# Altium schematic sheet STM32F103ZET6_HARDWARE.SchDoc: The robot embedded motherboar
size A4; CompanyName: 中煤科工集团重庆研究院; DrawnBy: leiyitan; Engineer: leiyitan@qq.com; Revision: V3.0; SheetNumber: 1; DocumentName: STM32F103ZET6_HARDWARE.SchDoc
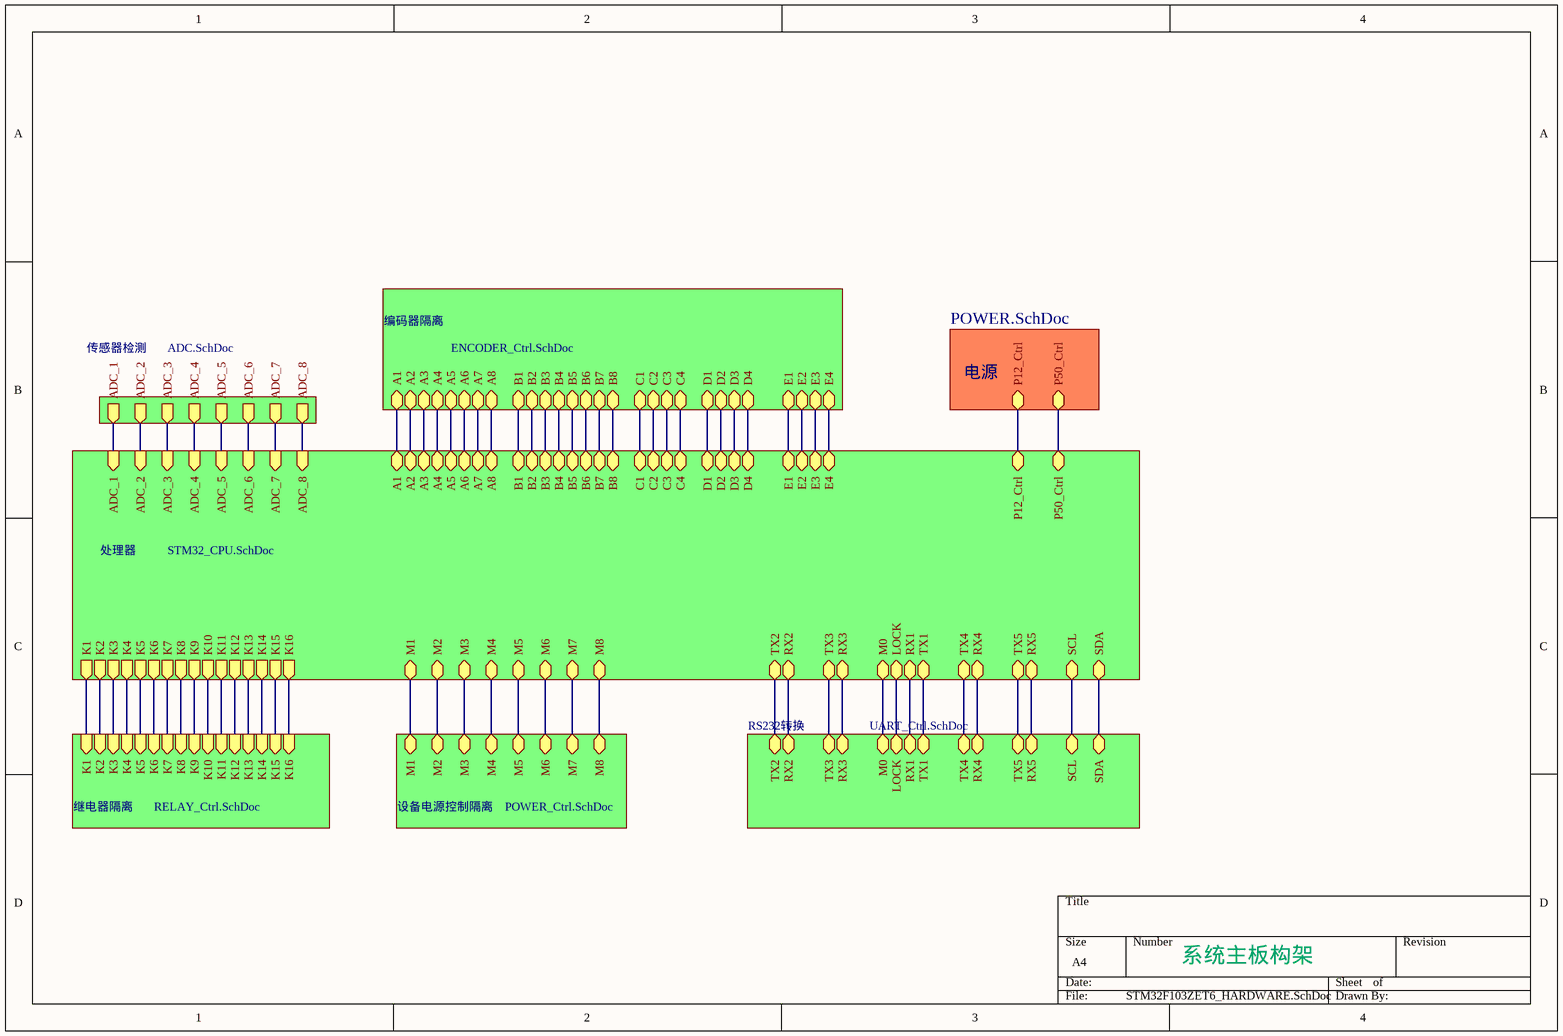
[diagram p0: STM32F103ZET6_HARDWARE.SchDoc]

## Sub-sheets
RS232转换 = UART_Ctrl.SchDoc: TX2, RX2, TX3, RX3, RX1, TX1, RX4 (bidir), TX4 (bidir), TX5 (bidir), RX5 (bidir), SCL (bidir), SDA (bidir), LOCK, M0
传感器检测 = ADC.SchDoc: ADC_1 (out), ADC_2 (out), ADC_3 (out), ADC_4 (out), ADC_5 (out), ADC_6 (out), ADC_7 (out), ADC_8 (out)
处理器 = STM32_CPU.SchDoc: TX1, RX1, TX2, RX2, TX3, RX3, TX4 (bidir), RX4 (bidir), M1 (bidir), M2 (bidir), M3 (bidir), M4 (bidir), M5 (bidir), M6 (bidir), M7 (bidir), M8 (bidir), K1 (out), K2 (out), K3 (out), K4 (out), K5 (out), K6 (out), A2, A4, A3, ADC_1 (in), ADC_2 (in), ADC_3 (in), ADC_4 (in), ADC_5 (in), ADC_6 (in), ADC_7 (in), ADC_8 (in), K7 (out), K8 (out), TX5 (bidir), RX5 (bidir), A1, A6, A8, A7, A5, B2 (bidir), B4 (bidir), B3 (bidir), B1 (bidir), B6 (bidir), B8 (bidir), B7 (bidir), B5 (bidir), C2 (bidir), C4 (bidir), C3 (bidir), C1 (bidir), D2 (bidir), D4 (bidir), D3 (bidir), D1 (bidir), K9 (out), K10 (out), K11 (out), K12 (out), K13 (out), K14 (out), K15 (out), K16 (out), SCL (bidir), SDA (bidir), E2 (bidir), E4 (bidir), E3 (bidir), E1 (bidir), P50_Ctrl (bidir), P12_Ctrl (bidir), LOCK, M0
电源 = POWER.SchDoc: P50_Ctrl (bidir), P12_Ctrl (bidir)
继电器隔离 = RELAY_Ctrl.SchDoc: K1 (in), K2 (in), K3 (in), K4 (in), K5 (in), K6 (in), K7 (in), K8 (in), K9 (in), K10 (in), K11 (in), K12 (in), K13 (in), K14 (in), K15 (in), K16 (in)
编码器隔离 = ENCODER_Ctrl.SchDoc: A2, A4, A3, A1, A6, A8, A7, A5, B2 (bidir), B4 (bidir), B3 (bidir), B1 (bidir), B6 (bidir), B8 (bidir), B7 (bidir), B5 (bidir), C2 (bidir), C4 (bidir), C3 (bidir), C1 (bidir), D2 (bidir), D4 (bidir), D3 (bidir), D1 (bidir), E2 (bidir), E4 (bidir), E3 (bidir), E1 (bidir)
设备电源控制隔离 = POWER_Ctrl.SchDoc: M1 (bidir), M2 (bidir), M3 (bidir), M4 (bidir), M5 (bidir), M6 (bidir), M7 (bidir), M8 (bidir)

## Nets
(unnamed): sheet 电源/P50_Ctrl, sheet 处理器/P50_Ctrl
(unnamed): sheet 电源/P12_Ctrl, sheet 处理器/P12_Ctrl
(unnamed): sheet 处理器/TX1, sheet RS232转换/TX1
(unnamed): sheet 处理器/RX1, sheet RS232转换/RX1
(unnamed): sheet 处理器/TX2, sheet RS232转换/TX2
(unnamed): sheet 处理器/RX2, sheet RS232转换/RX2
(unnamed): sheet 处理器/TX3, sheet RS232转换/TX3
(unnamed): sheet 处理器/RX3, sheet RS232转换/RX3
(unnamed): sheet 处理器/TX4, sheet RS232转换/TX4
(unnamed): sheet 处理器/RX4, sheet RS232转换/RX4
(unnamed): sheet 处理器/M1, sheet 设备电源控制隔离/M1
(unnamed): sheet 处理器/M2, sheet 设备电源控制隔离/M2
(unnamed): sheet 处理器/M3, sheet 设备电源控制隔离/M3
(unnamed): sheet 处理器/M4, sheet 设备电源控制隔离/M4
(unnamed): sheet 处理器/M5, sheet 设备电源控制隔离/M5
(unnamed): sheet 处理器/M6, sheet 设备电源控制隔离/M6
(unnamed): sheet 处理器/M7, sheet 设备电源控制隔离/M7
(unnamed): sheet 处理器/M8, sheet 设备电源控制隔离/M8
(unnamed): sheet 处理器/K1, sheet 继电器隔离/K1
(unnamed): sheet 处理器/K2, sheet 继电器隔离/K2
(unnamed): sheet 处理器/K3, sheet 继电器隔离/K3
(unnamed): sheet 处理器/K4, sheet 继电器隔离/K4
(unnamed): sheet 处理器/K5, sheet 继电器隔离/K5
(unnamed): sheet 处理器/K6, sheet 继电器隔离/K6
(unnamed): sheet 处理器/A2, sheet 编码器隔离/A2
(unnamed): sheet 处理器/A4, sheet 编码器隔离/A4
(unnamed): sheet 处理器/A3, sheet 编码器隔离/A3
(unnamed): sheet 处理器/ADC_1, sheet 传感器检测/ADC_1
(unnamed): sheet 处理器/ADC_2, sheet 传感器检测/ADC_2
(unnamed): sheet 处理器/ADC_3, sheet 传感器检测/ADC_3
(unnamed): sheet 处理器/ADC_4, sheet 传感器检测/ADC_4
(unnamed): sheet 处理器/ADC_5, sheet 传感器检测/ADC_5
(unnamed): sheet 处理器/ADC_6, sheet 传感器检测/ADC_6
(unnamed): sheet 处理器/ADC_7, sheet 传感器检测/ADC_7
(unnamed): sheet 处理器/ADC_8, sheet 传感器检测/ADC_8
(unnamed): sheet 处理器/K7, sheet 继电器隔离/K7
(unnamed): sheet 处理器/K8, sheet 继电器隔离/K8
(unnamed): sheet 处理器/TX5, sheet RS232转换/TX5
(unnamed): sheet 处理器/RX5, sheet RS232转换/RX5
(unnamed): sheet 处理器/A1, sheet 编码器隔离/A1
(unnamed): sheet 处理器/A6, sheet 编码器隔离/A6
(unnamed): sheet 处理器/A8, sheet 编码器隔离/A8
(unnamed): sheet 处理器/A7, sheet 编码器隔离/A7
(unnamed): sheet 处理器/A5, sheet 编码器隔离/A5
(unnamed): sheet 处理器/B2, sheet 编码器隔离/B2
(unnamed): sheet 处理器/B4, sheet 编码器隔离/B4
(unnamed): sheet 处理器/B3, sheet 编码器隔离/B3
(unnamed): sheet 处理器/B1, sheet 编码器隔离/B1
(unnamed): sheet 处理器/B6, sheet 编码器隔离/B6
(unnamed): sheet 处理器/B8, sheet 编码器隔离/B8
(unnamed): sheet 处理器/B7, sheet 编码器隔离/B7
(unnamed): sheet 处理器/B5, sheet 编码器隔离/B5
(unnamed): sheet 处理器/C2, sheet 编码器隔离/C2
(unnamed): sheet 处理器/C4, sheet 编码器隔离/C4
(unnamed): sheet 处理器/C3, sheet 编码器隔离/C3
(unnamed): sheet 处理器/C1, sheet 编码器隔离/C1
(unnamed): sheet 处理器/D2, sheet 编码器隔离/D2
(unnamed): sheet 处理器/D4, sheet 编码器隔离/D4
(unnamed): sheet 处理器/D3, sheet 编码器隔离/D3
(unnamed): sheet 处理器/D1, sheet 编码器隔离/D1
(unnamed): sheet 处理器/K9, sheet 继电器隔离/K9
(unnamed): sheet 处理器/K10, sheet 继电器隔离/K10
(unnamed): sheet 处理器/K11, sheet 继电器隔离/K11
(unnamed): sheet 处理器/K12, sheet 继电器隔离/K12
(unnamed): sheet 处理器/K13, sheet 继电器隔离/K13
(unnamed): sheet 处理器/K14, sheet 继电器隔离/K14
(unnamed): sheet 处理器/K15, sheet 继电器隔离/K15
(unnamed): sheet 处理器/K16, sheet 继电器隔离/K16
(unnamed): sheet 处理器/SCL, sheet RS232转换/SCL
(unnamed): sheet 处理器/SDA, sheet RS232转换/SDA
(unnamed): sheet 处理器/E2, sheet 编码器隔离/E2
(unnamed): sheet 处理器/E4, sheet 编码器隔离/E4
(unnamed): sheet 处理器/E3, sheet 编码器隔离/E3
(unnamed): sheet 处理器/E1, sheet 编码器隔离/E1
(unnamed): sheet 处理器/LOCK, sheet RS232转换/LOCK
(unnamed): sheet 处理器/M0, sheet RS232转换/M0

## Notes on the sheet
- 系统主板构架